# EAGLE design lighting_led (EAGLE 9.7.0)
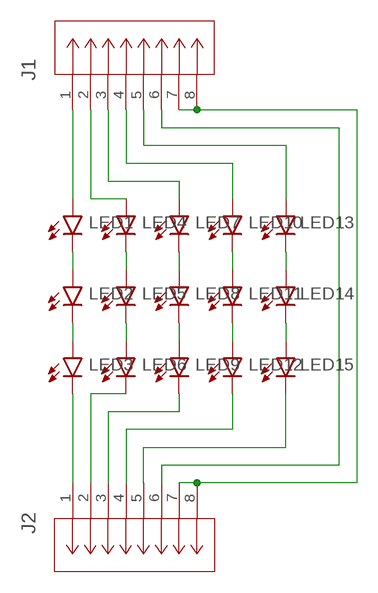
[diagram p0: schematic, sheet 1]

## Parts
J1  5055780671  [CON_5055780671]
J2  5055780671  [CON_5055780671]
LED1  XLAMP_XP-G3_ROYAL  [XLAMP_XP-G3]
LED2  XLAMP_XP-G3_ROYAL  [XLAMP_XP-G3]
LED3  XLAMP_XP-G3_ROYAL  [XLAMP_XP-G3]
LED4  XLAMP_XP-G3_COOL  [XLAMP_XP-G3]
LED5  XLAMP_XP-G3_COOL  [XLAMP_XP-G3]
LED6  XLAMP_XP-G3_COOL  [XLAMP_XP-G3]
LED7  XLAMP_XP-G3_WARM  [XLAMP_XP-G3]
LED8  XLAMP_XP-G3_WARM  [XLAMP_XP-G3]
LED9  XLAMP_XP-G3_WARM  [XLAMP_XP-G3]
LED10  XLAMP_XP-G3_PHOTO  [XLAMP_XP-G3]
LED11  XLAMP_XP-G3_PHOTO  [XLAMP_XP-G3]
LED12  XLAMP_XP-G3_PHOTO  [XLAMP_XP-G3]
LED13  XLAMP_XP-E2  [XLAMP_XP-E2]
LED14  XLAMP_XP-E2  [XLAMP_XP-E2]
LED15  XLAMP_XP-E2  [XLAMP_XP-E2]

## Nets
N$1: LED4.P$2(C) LED5.P$1(A)
N$2: LED1.P$2(C) LED2.P$1(A)
N$3: LED2.P$2(C) LED3.P$1(A)
N$4: LED5.P$2(C) LED6.P$1(A)
N$5: LED7.P$2(C) LED8.P$1(A)
N$6: LED8.P$2(C) LED9.P$1(A)
N$7: LED10.P$2(C) LED11.P$1(A)
N$8: LED11.P$2(C) LED12.P$1(A)
N$9: LED13.P$2(C) LED14.P$1(A)
N$10: LED14.P$2(C) LED15.P$1(A)
N$11: J1.1 LED1.P$1(A)
N$12: J1.2 LED4.P$1(A)
N$13: J1.3 LED7.P$1(A)
N$14: J1.4 LED10.P$1(A)
N$15: J1.5 LED13.P$1(A)
N$16: J1.6 J2.6
N$17: J1.7 J1.8 J2.7 J2.8
N$18: J2.5 LED15.P$2(C)
N$19: J2.4 LED12.P$2(C)
N$20: J2.3 LED9.P$2(C)
N$21: J2.2 LED6.P$2(C)
N$22: J2.1 LED3.P$2(C)

## Library data of the parts
J1 J2 = Molex Micro-Lock PLUS 6-pin (90deg):5055780671; BUILT_BY: Molex_Team; COPYRIGHT: Copyright (C) 2018 Accelerated Designs. All rights reserved; MANUFACTURER_PART_NUMBER: 5055780671; SOURCELIBRARY: Add_to_database_2021-02-15; VENDOR: Molex Connector Corporation
LED1-LED3 = XLAMP XP-G3 Royal Blue:XLAMP_XP-G3_ROYAL
LED4-LED6 = XLAMP XP-G3 Cool White:XLAMP_XP-G3_COOL
LED7-LED9 = XLAMP XP-G3 Warm White:XLAMP_XP-G3_WARM
LED10-LED12 = XLAMP XP-G3 Photo Red:XLAMP_XP-G3_PHOTO
LED13-LED15 = XLAMP XP-E2 Far Red:XLAMP_XP-E2

## Board
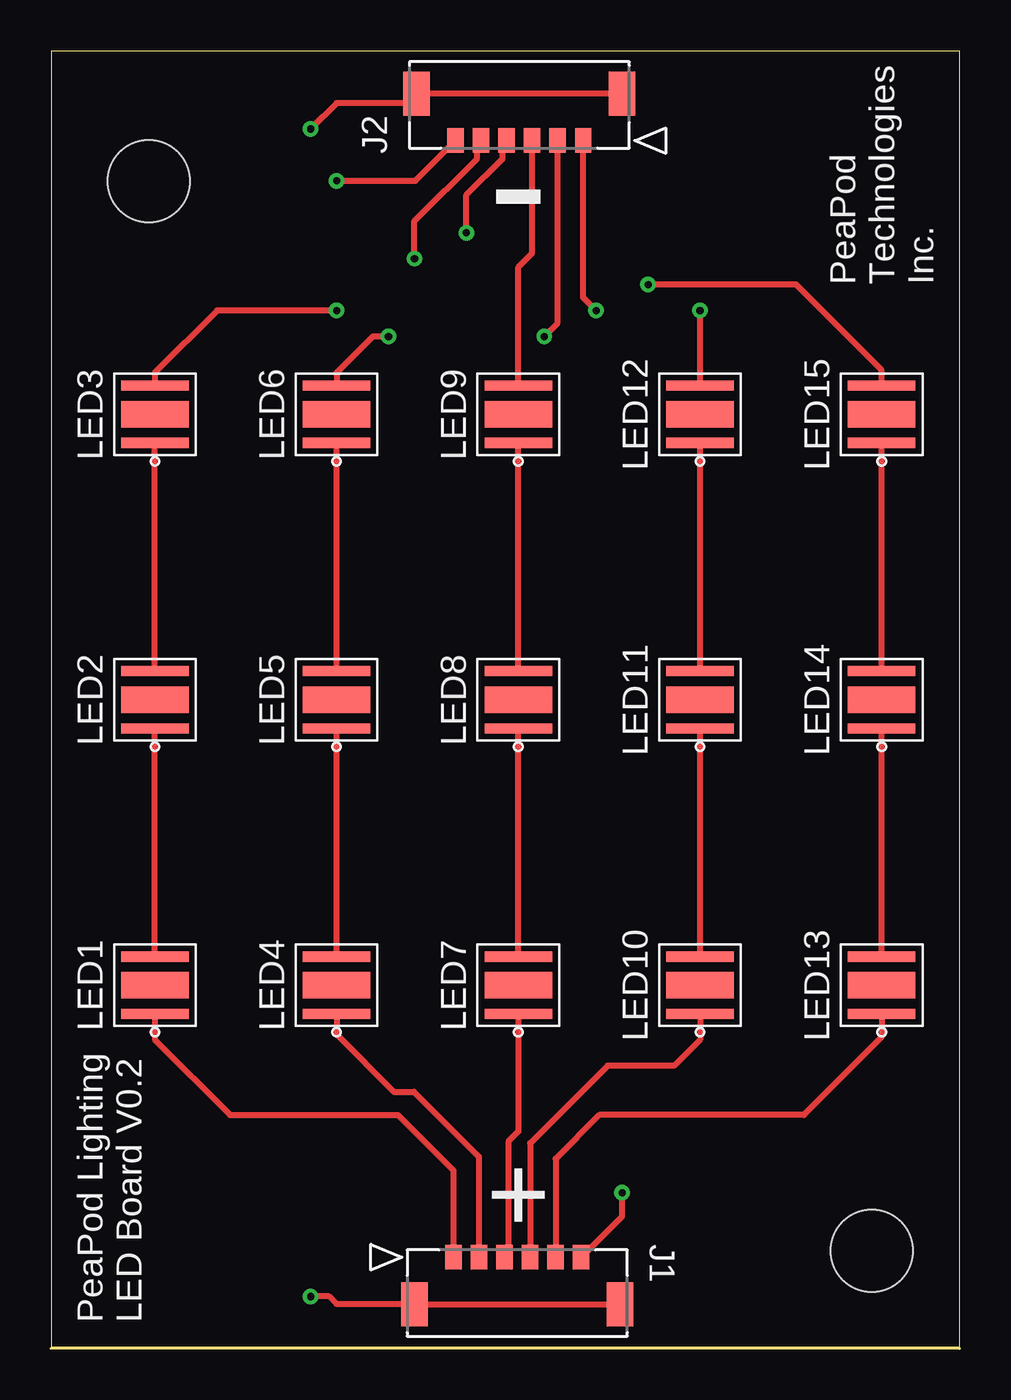
[diagram p1: board, top side]
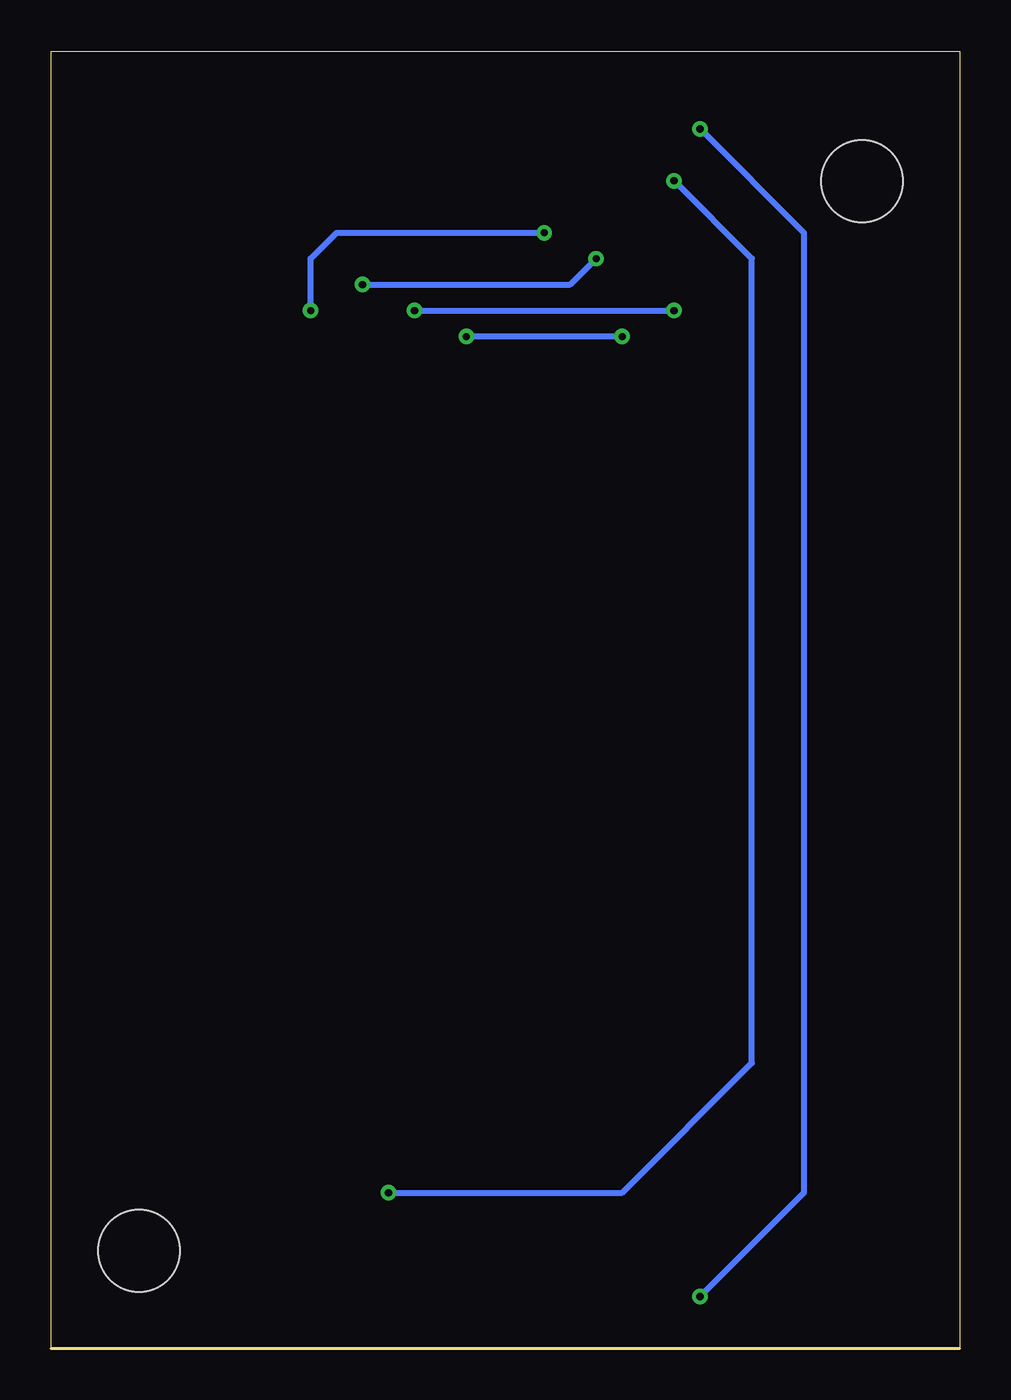
[diagram p2: board, bottom side, seen from below]

Size 44.45 x 63.5 mm. Coordinates in mm from the lower left corner, seen from the top.
Outline: 44.45,0 44.45,63.5 0,63.5 0,0 44.45,0
Copper layers (1*16): Top 0.035mm / dielectric 1.5mm / Bottom 0.035mm
Design rules "default": minimum track width 6mil, minimum drill 0.35mm, track to track 6mil, track to pad 6mil, pad to pad 6mil, via to via 6mil, smd to smd 6mil, copper to edge 40mil, drill to drill 6mil, minimum pad ring 10mil, minimum via ring 8mil, stop-mask expansion 4mil, vias tented up to drill 0mil, thermal gap 10mil
Holes 4 mm at 4.78,57.12 40.15,4.77

### Footprints (pad centres in the part's own frame; a part is rotated, then mirrored left to right if it is on the bottom)
CON_5055670671 = smd 0.8 x 1.2: 1 0,0; 2 -1.25,0; 3 -2.5,0; 4 -3.75,0; 5 -5,0; 6 -6.25,0 | smd 1.3 x 2.15: 7 1.9,2.295; 8 -8.15,2.295
XLAMP_XP-G3_BLUE = smd 1.3 x 3.3: NC 0,0 | smd 0.5 x 3.3: P$1 -1.4,0; P$2 1.4,0
XLAMP_XP-G3_COOL = smd 1.3 x 3.3: NC 0,0 | smd 0.5 x 3.3: P$1 -1.4,0; P$2 1.4,0
XLAMP_XP-G3_WARM = smd 1.3 x 3.3: NC 0,0 | smd 0.5 x 3.3: P$1 -1.4,0; P$2 1.4,0
XLAMP_XP-G3_RED = smd 1.3 x 3.3: NC 0,0 | smd 0.5 x 3.3: P$1 -1.4,0; P$2 1.4,0
XLAMP_XP-E2 = smd 1.3 x 3.3: NC 0,0 | smd 0.5 x 3.3: P$1 -1.4,0; P$2 1.4,0

### Placement (x,y rotation side)
J1  MOLEX-MICROLOCK-6PIN  [CON_5055670671]  19.68,4.46 180 top
J2  MOLEX-MICROLOCK-6PIN  [CON_5055670671]  26.04,59.11 0 top
LED1  XP-G3_BLUE  [XLAMP_XP-G3_BLUE]  5.08,17.78 90 top
LED2  XP-G3_BLUE  [XLAMP_XP-G3_BLUE]  5.08,31.75 90 top
LED3  XP-G3_BLUE  [XLAMP_XP-G3_BLUE]  5.08,45.72 90 top
LED4  XP-G3_COOL  [XLAMP_XP-G3_COOL]  13.97,17.78 90 top
LED5  XP-G3_COOL  [XLAMP_XP-G3_COOL]  13.97,31.75 90 top
LED6  XP-G3_COOL  [XLAMP_XP-G3_COOL]  13.97,45.72 90 top
LED7  XP-G3_WARM  [XLAMP_XP-G3_WARM]  22.86,17.78 90 top
LED8  XP-G3_WARM  [XLAMP_XP-G3_WARM]  22.86,31.75 90 top
LED9  XP-G3_WARM  [XLAMP_XP-G3_WARM]  22.86,45.72 90 top
LED10  XP-G3_RED  [XLAMP_XP-G3_RED]  31.75,17.78 90 top
LED11  XP-G3_RED  [XLAMP_XP-G3_RED]  31.75,31.75 90 top
LED12  XP-G3_RED  [XLAMP_XP-G3_RED]  31.75,45.72 90 top
LED13  40.64,17.78 90 top
LED14  40.64,31.75 90 top
LED15  40.64,45.72 90 top

### Tracks (layer width: path | path; a pad name or v marks a point on that pad's centre or on a via)
N$1
  Top 0.305: LED4.P$2 LED5.P$1
N$2
  Top 0.305: LED1.P$2 LED2.P$1
N$3
  Top 0.305: LED2.P$2 LED3.P$1
N$4
  Top 0.305: LED5.P$2 LED6.P$1
N$5
  Top 0.305: LED7.P$2 LED8.P$1
N$6
  Top 0.305: LED8.P$2 LED9.P$1
N$7
  Top 0.305: LED10.P$2 LED11.P$1
N$8
  Top 0.305: LED11.P$2 LED12.P$1
N$9
  Top 0.305: LED13.P$2 LED14.P$1
N$10
  Top 0.305: LED14.P$2 LED15.P$1
N$11
  Top 0.305: LED1.P$1 5.08,15.11 8.76,11.43 16.97,11.43 19.68,8.71 J1.1
N$12
  Top 0.305: LED4.P$1 13.97,15.36 16.76,12.57 17.75,12.57 20.93,9.38 J1.2
N$13
  Top 0.305: J1.3 22.38,4.65 22.38,10.13 22.86,10.62 LED7.P$1
N$14
  Top 0.305: LED10.P$1 31.75,15.11 30.48,13.84 27.23,13.84 23.43,10.04 J1.4
N$15
  Top 0.305: LED13.P$1 40.64,15.24 36.83,11.43 26.82,11.43 24.68,9.29 J1.5
N$16  (via drill 0.35)
  Top 0.305: J1.6 27.94,6.47 v27.94,7.62 | v13.97,57.15 17.82,57.15 J2.6
  Bottom 0.305: v27.94,7.62 16.51,7.62 10.16,13.97 10.16,53.34 v13.97,57.15
N$17  (via drill 0.35)
  Top 0.305: J1.8 J1.7 13.97,2.17 13.6,2.54 v12.7,2.54 | J2.7 J2.8 17.44,60.96 13.97,60.96 v12.7,59.69
  Bottom 0.305: v12.7,59.69 7.62,54.61 7.62,7.62 v12.7,2.54
N$18  (via drill 0.35)
  Top 0.305: LED15.P$2 40.64,47.88 36.45,52.07 v29.21,52.07 | J2.5 20.84,58.92 20.84,58.24 17.78,55.18 v17.78,53.34
  Bottom 0.305: v29.21,52.07 19.05,52.07 v17.78,53.34
N$19  (via drill 0.35)
  Top 0.305: LED12.P$2 v31.75,50.8 | J2.4 22.09,58.92 22.09,58.24 20.32,56.47 v20.32,54.61
  Bottom 0.305: v31.75,50.8 31.75,53.34 30.48,54.61 v20.32,54.61
N$20
  Top 0.305: LED9.P$2 22.86,52.92 23.54,53.6 J2.3
N$21  (via drill 0.35)
  Top 0.305: v16.51,49.53 15.75,49.53 13.97,47.75 LED6.P$2 | v24.13,49.53 24.79,50.19 J2.2
  Bottom 0.305: v16.51,49.53 v24.13,49.53
N$22  (via drill 0.35)
  Top 0.305: LED3.P$2 5.08,47.76 8.12,50.8 v13.97,50.8 | v26.67,50.8 26.04,51.44 J2.1
  Bottom 0.305: v26.67,50.8 v13.97,50.8

### Text on the board
tPlace: - | PeaPod / Technologies / Inc. | + | PeaPod Lighting / LED Board V0.2